# Altium schematic sheet ThermistorTop with Connector.SchDoc
size A
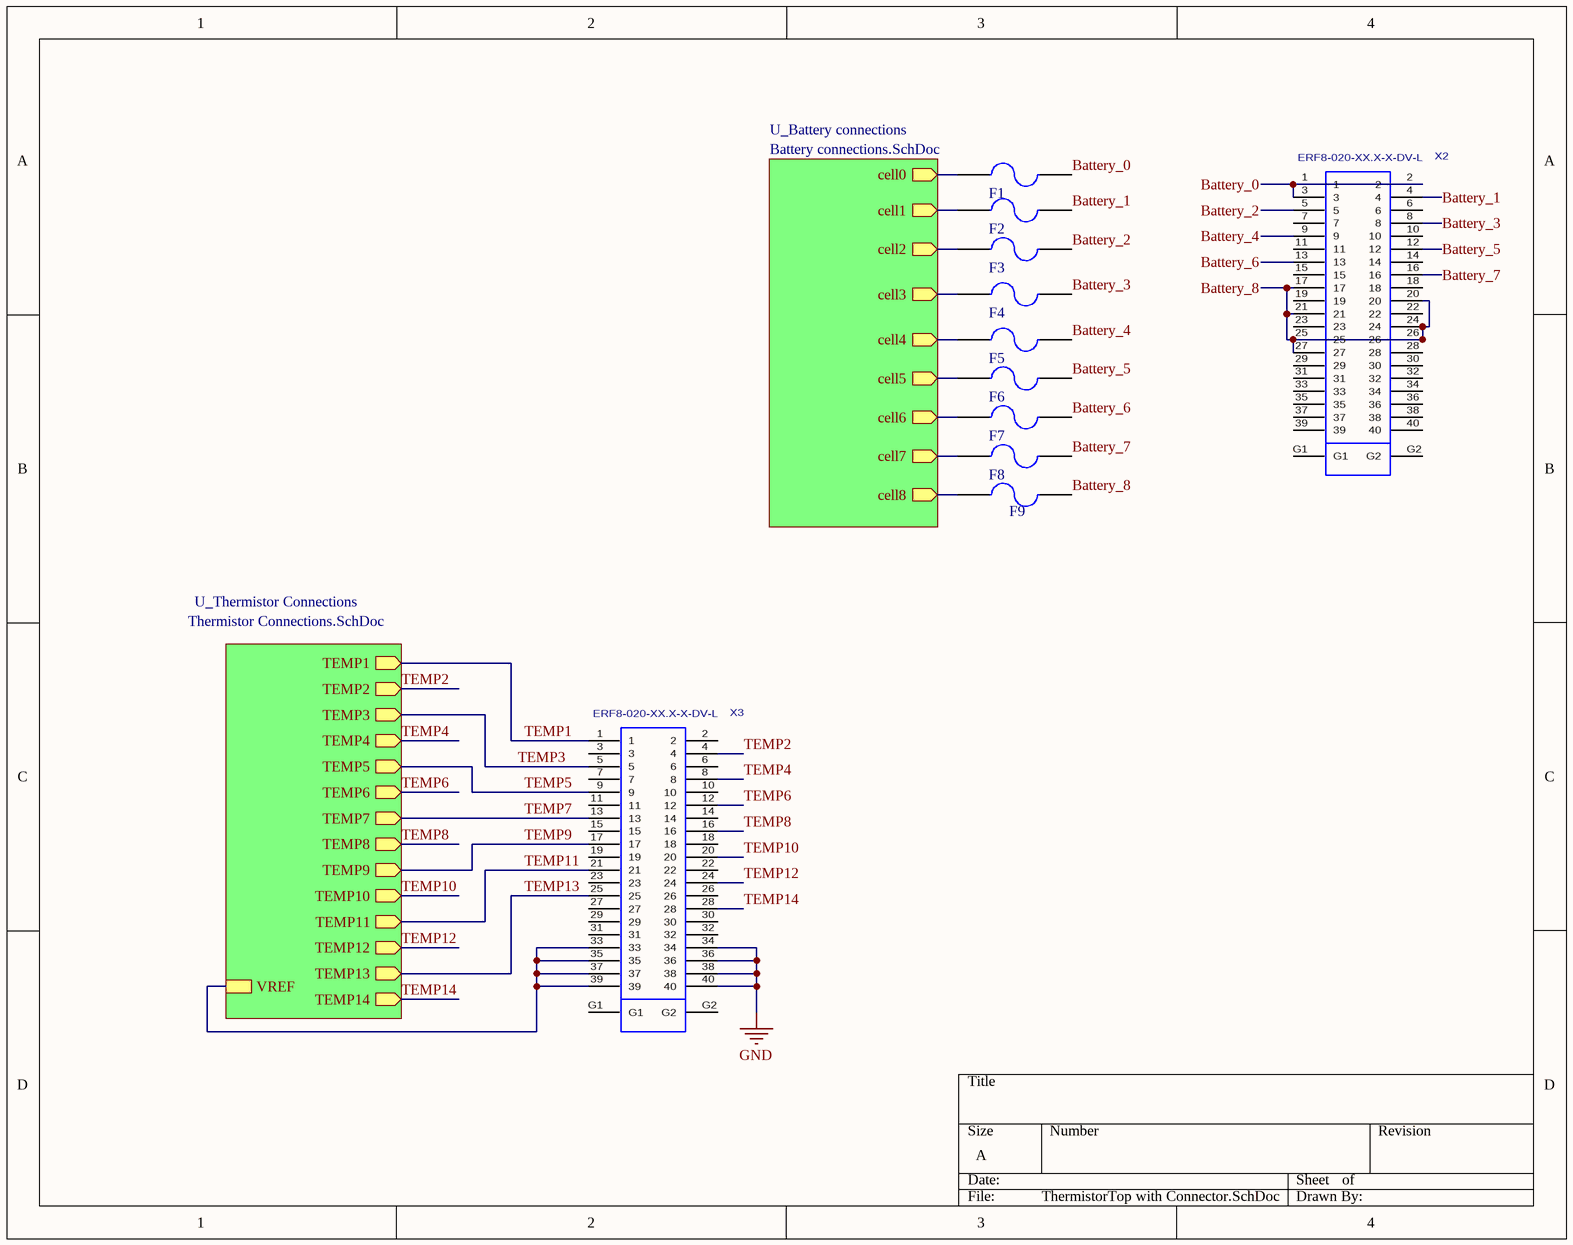
[diagram p0: ThermistorTop with Connector.SchDoc]

## Parts
F1  Fuse  [NTC 0805/2012]  (value not drawn)
F2  Fuse  [NTC 0805/2012]  (value not drawn)
F3  Fuse  [NTC 0805/2012]  (value not drawn)
F4  Fuse  [NTC 0805/2012]  (value not drawn)
F5  Fuse  [NTC 0805/2012]  (value not drawn)
F6  Fuse  [NTC 0805/2012]  (value not drawn)
F7  Fuse  [NTC 0805/2012]  (value not drawn)
F8  Fuse  [NTC 0805/2012]  (value not drawn)
F9  Fuse  [NTC 0805/2012]  (value not drawn)
X2  ERF8-020-XX.X-X-DV-L  [ERF8-020-XX.X-X-DV-L]
X3  ERF8-020-XX.X-X-DV-L  [ERF8-020-XX.X-X-DV-L]

## Sub-sheets
U_Battery connections = Battery connections.SchDoc: cell0 (out), cell1 (out), cell2 (out), cell3 (out), cell4 (out), cell5 (out), cell6 (out), cell7 (out), cell8 (out)
U_Thermistor Connections = Thermistor Connections.SchDoc: VREF, TEMP1 (out), TEMP2 (out), TEMP3 (out), TEMP4 (out), TEMP5 (out), TEMP6 (out), TEMP7 (out), TEMP8 (out), TEMP9 (out), TEMP10 (out), TEMP11 (out), TEMP12 (out), TEMP13 (out), TEMP14 (out)

## Nets
GND: X3.34 X3.36 X3.38 X3.40
Battery_0: F1.2 X2.1 X2.2 X2.3
Battery_1: F2.2 X2.4
Battery_2: F3.2 X2.5
Battery_3: F4.2 X2.8
Battery_4: F5.2 X2.9
Battery_5: F6.2 X2.12
Battery_6: F7.2 X2.13
Battery_7: F8.2 X2.16
Battery_8: F9.2 X2.17 X2.20 X2.21 X2.24 X2.25 X2.26 X2.27
TEMP1: X3.1 ; sheet U_Thermistor Connections/TEMP1
TEMP2: X3.4 ; sheet U_Thermistor Connections/TEMP2
TEMP3: X3.5 ; sheet U_Thermistor Connections/TEMP3
TEMP4: X3.8 ; sheet U_Thermistor Connections/TEMP4
TEMP5: X3.9 ; sheet U_Thermistor Connections/TEMP5
TEMP6: X3.12 ; sheet U_Thermistor Connections/TEMP6
TEMP7: X3.13 ; sheet U_Thermistor Connections/TEMP7
TEMP8: X3.16 ; sheet U_Thermistor Connections/TEMP8
TEMP9: X3.17 ; sheet U_Thermistor Connections/TEMP9
TEMP10: X3.20 ; sheet U_Thermistor Connections/TEMP10
TEMP11: X3.21 ; sheet U_Thermistor Connections/TEMP11
TEMP12: X3.24 ; sheet U_Thermistor Connections/TEMP12
TEMP13: X3.25 ; sheet U_Thermistor Connections/TEMP13
TEMP14: X3.28 ; sheet U_Thermistor Connections/TEMP14
NetF1_1: F1.1 ; sheet U_Battery connections/cell0
NetF2_1: F2.1 ; sheet U_Battery connections/cell1
NetF3_1: F3.1 ; sheet U_Battery connections/cell2
NetF4_1: F4.1 ; sheet U_Battery connections/cell3
NetF5_1: F5.1 ; sheet U_Battery connections/cell4
NetF6_1: F6.1 ; sheet U_Battery connections/cell5
NetF7_1: F7.1 ; sheet U_Battery connections/cell6
NetF8_1: F8.1 ; sheet U_Battery connections/cell7
NetF9_1: F9.1 ; sheet U_Battery connections/cell8
NetX3_33: X3.33 X3.35 X3.37 X3.39 ; sheet U_Thermistor Connections/VREF

Not connected (* = marked no-connect by the designer): X2 6 7 10 11 14 15 18 19 22 23 28 29 30 31 32 33 34 35 36 37 38 39 40 G1 G2; X3 2 3 6 7 10 11 14 15 18 19 22 23 26 27 29 30 31 32 G1 G2

## Library data of the parts
F1-F9 = 12: FUSE BOARD MOUNT 1A 32VDC 0805; id: 12; Name: MFU0805FF01000P100; itrip: 1; iinterrupt: 50; vmax: 32; quantity: 0; link: https://www.digikey.com/product-detail/en/vishay-beyschlag/MFU0805FF01000P100/MFU08051.00CT-ND/1206546; createdby: Haley
X2 X3 = 36: MANUFACTURER: SAMTEC; PCB DECAL: ERM8-020-XX.X-X-DV-L; id: 36; numcontacts: 40; numrows: 2; CREATED: August 17, 2016 - Wendy Xin; name: ERF8-020-XX.X-X-DV-L; quantity: 0; link: https://www.digikey.com/product-detail/en/samtec-inc/ERF8-020-05.0-S-DV-L-TR/SAM13554CT-ND/9593848; createdby: Haley